# Altium schematic sheet EPS_Battery_Controller_RLCL.SchDoc: Battery / Controller / RLCL
size A4; SheetNumber: 28; SheetTotal: 51
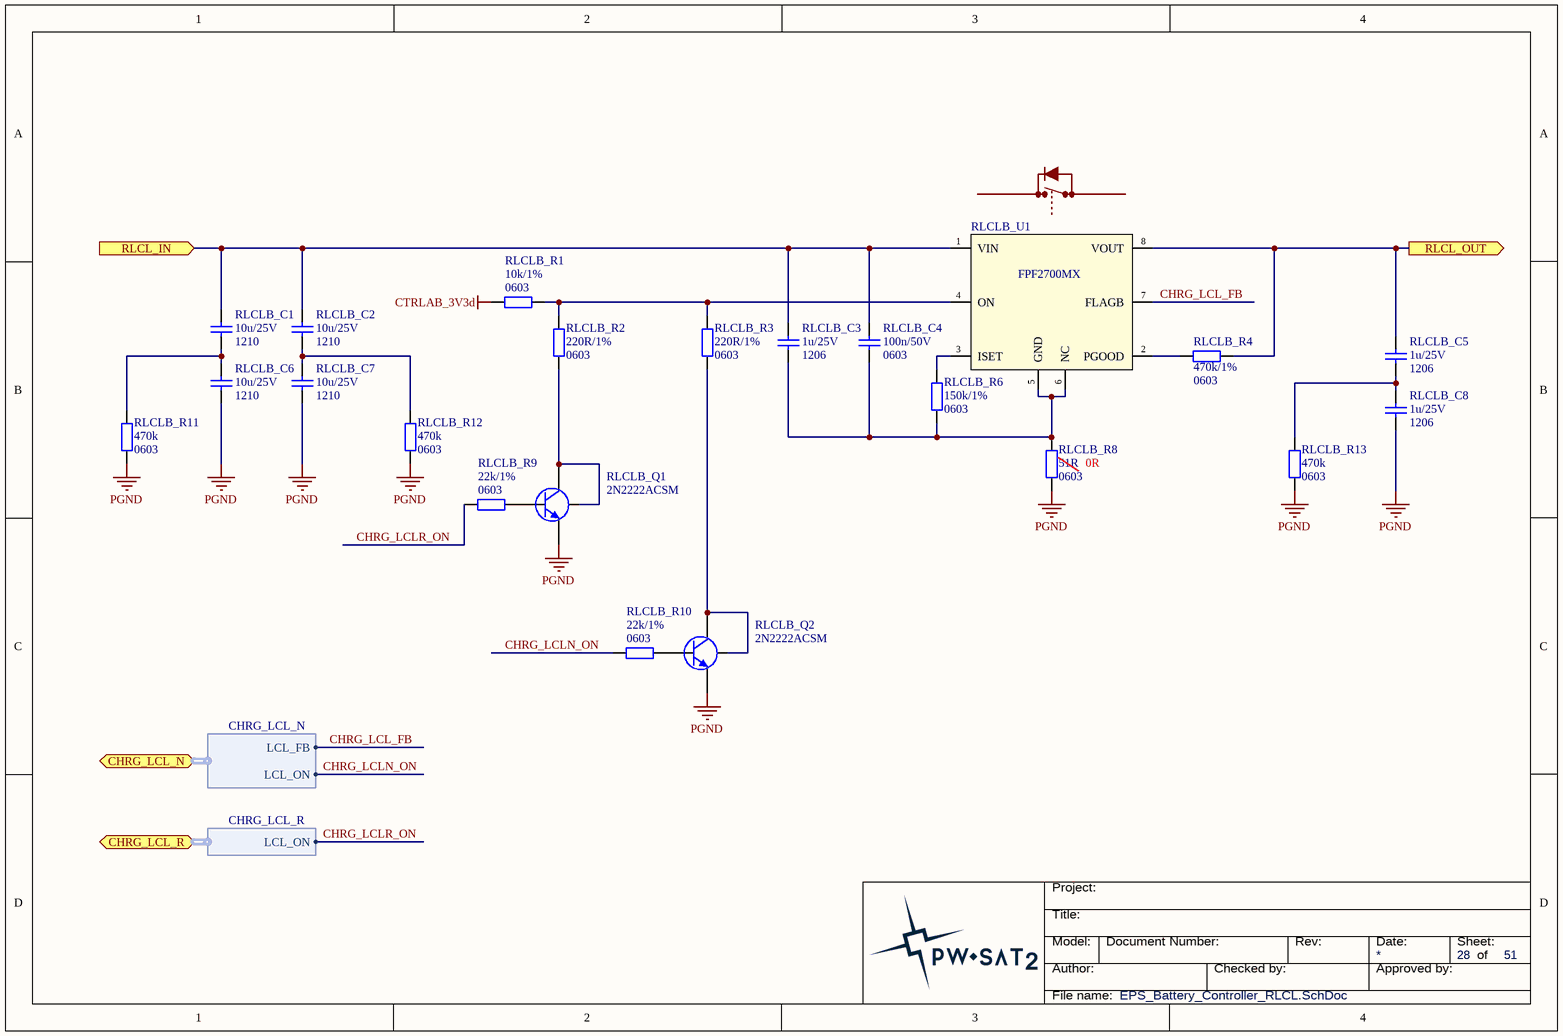
[diagram p0: EPS_Battery_Controller_RLCL.SchDoc]

## Parts
RLCLB_C1  Package: 1210  [SMD_Capacitor_1210]  (hidden comment: 10u/25V)
RLCLB_C2  Package: 1210  [SMD_Capacitor_1210]  (hidden comment: 10u/25V)
RLCLB_C3  Package: 1206  [SMD_Capacitor_1206]  (hidden comment: 1u/25V)
RLCLB_C4  Package: 0603  [SMD_Capacitor_0603]  (hidden comment: 100n/50V)
RLCLB_C5  Package: 1206  [SMD_Capacitor_1206]  (hidden comment: 1u/25V)
RLCLB_C6  Package: 1210  [SMD_Capacitor_1210]  (hidden comment: 10u/25V)
RLCLB_C7  Package: 1210  [SMD_Capacitor_1210]  (hidden comment: 10u/25V)
RLCLB_C8  Package: 1206  [SMD_Capacitor_1206]  (hidden comment: 1u/25V)
RLCLB_Q1  2N2222ACSM  [LCC1-4_BEC]
RLCLB_Q2  2N2222ACSM  [LCC1-4_BEC]
RLCLB_R1  Package: 0603  [SMD_Resistor_0603]  (hidden comment: 10k/1%)
RLCLB_R2  Package: 0603  [SMD_Resistor_0603]  (hidden comment: 220R/1%)
RLCLB_R3  Package: 0603  [SMD_Resistor_0603]  (hidden comment: 220R/1%)
RLCLB_R4  Package: 0603  [SMD_Resistor_0603]  (hidden comment: 470k/1%)
RLCLB_R6  Package: 0603  [SMD_Resistor_0603]  (hidden comment: 150k/1%)
RLCLB_R8  Package: 0603  [SMD_Resistor_0603]  (hidden comment: 51R)
RLCLB_R9  Package: 0603  [SMD_Resistor_0603]  (hidden comment: 22k/1%)
RLCLB_R10  Package: 0603  [SMD_Resistor_0603]  (hidden comment: 22k/1%)
RLCLB_R11  Package: 0603  [SMD_Resistor_0603]  (hidden comment: 470k)
RLCLB_R12  Package: 0603  [SMD_Resistor_0603]  (hidden comment: 470k)
RLCLB_R13  Package: 0603  [SMD_Resistor_0603]  (hidden comment: 470k)
RLCLB_U1  FPF2700MX  [SOIC-8-N]

## Ports
CHRG_LCL_N (harness CHRG_LCL_N), CHRG_LCL_R (harness CHRG_LCL_R), RLCL_IN (in), RLCL_OUT (out)

## Harnesses
CHRG_LCL_N: LCL_FB, LCL_ON
CHRG_LCL_R: LCL_ON

## Nets
CTRLAB_3V3d: RLCLB_R1.2
PGND: RLCLB_C6.2 RLCLB_C7.2 RLCLB_C8.2 RLCLB_Q1.E RLCLB_Q2.E RLCLB_R8.2 RLCLB_R11.2 RLCLB_R12.2 RLCLB_R13.2
CHRG_LCL_FB: RLCLB_U1.7(FLAGB) ; port CHRG_LCL_N.LCL_FB
CHRG_LCLN_ON: RLCLB_R10.1 ; port CHRG_LCL_N.LCL_ON
CHRG_LCLR_ON: RLCLB_R9.1 ; port CHRG_LCL_R.LCL_ON
RLCL_IN: RLCLB_C1.1 RLCLB_C2.1 RLCLB_C3.1 RLCLB_C4.1 RLCLB_U1.1(VIN) ; port RLCL_IN
RLCL_OUT: RLCLB_C5.1 RLCLB_R4.2 RLCLB_U1.8(VOUT) ; port RLCL_OUT
NetRLCLB_C1_2: RLCLB_C1.2 RLCLB_C6.1 RLCLB_R11.1
NetRLCLB_C2_2: RLCLB_C2.2 RLCLB_C7.1 RLCLB_R12.1
NetRLCLB_C3_2: RLCLB_C3.2 RLCLB_C4.2 RLCLB_R6.2 RLCLB_R8.1 RLCLB_U1.5(GND) RLCLB_U1.6(NC)
NetRLCLB_C5_2: RLCLB_C5.2 RLCLB_C8.1 RLCLB_R13.1
NetRLCLB_Q1_B: RLCLB_Q1.B RLCLB_R9.2
NetRLCLB_Q1_C: RLCLB_Q1.C RLCLB_Q1.Shield RLCLB_R2.2
NetRLCLB_Q2_B: RLCLB_Q2.B RLCLB_R10.2
NetRLCLB_Q2_C: RLCLB_Q2.C RLCLB_Q2.Shield RLCLB_R3.2
NetRLCLB_R1_1: RLCLB_R1.1 RLCLB_R2.1 RLCLB_R3.1 RLCLB_U1.4(ON)
NetRLCLB_R4_1: RLCLB_R4.1 RLCLB_U1.2(PGOOD)
NetRLCLB_R6_1: RLCLB_R6.1 RLCLB_U1.3(ISET)

## Notes on the sheet
- (near RLCLB_R8) 0R
- Title:
- Project:
- Author:
- Model:
- Document Number:
- Checked by:
- Rev:
- Date:
- Approved by:
- Sheet:
- of
- File name:

## Library data of the parts
RLCLB_C1 RLCLB_C2 RLCLB_C6 RLCLB_C7 = Cer_GCJ32ER71E106KA12L: Ceramic Cap Murata Automotive 10u/25V X7R 1210; Manufacturer: Murata; ManufacturerPartNumber: GCJ32ER71E106KA12L; Value: 10u/25V
RLCLB_C3 RLCLB_C5 RLCLB_C8 = Cer_C1206T105K3RALTU: Ceramic Cap Kemet COTS 1u/25V X7R 1206; ManufacturerPartNumber: C1206T105K3RALTU; Manufacturer: Kemet; Value: 1u/25V
RLCLB_C4 = Cer_GCJ188R71H104KA12D: Ceramic Cap Murata Automotive 100n/50V X7R 0603; Manufacturer: Murata; ManufacturerPartNumber: GCJ188R71H104KA12D; Value: 100n/50V
RLCLB_Q1 RLCLB_Q2 = 2N2222ACSM: Silicon Planar Epitaxial NPN Transistor.; Manufacturer: Semelab-TT; Value: 2N2222ACSM
RLCLB_R1-RLCLB_R4 RLCLB_R6 RLCLB_R8-RLCLB_R13 = Res
  RLCLB_R1: Value: 10k/1%
  RLCLB_R2 RLCLB_R3: Value: 220R/1%
  RLCLB_R4: Value: 470k/1%
  RLCLB_R6: Value: 150k/1%
  RLCLB_R8: Value: 51R
  RLCLB_R9 RLCLB_R10: Value: 22k/1%
  RLCLB_R11-RLCLB_R13: Value: 470k
RLCLB_U1 = FPF2700MX: Adj over-current protection 0.4-2A, Load Switch; Manufacturer: Fairchild Semiconductor; Value: FPF2700MX